# EAGLE design TeensyXBeeCan (EAGLE 7.7.0)
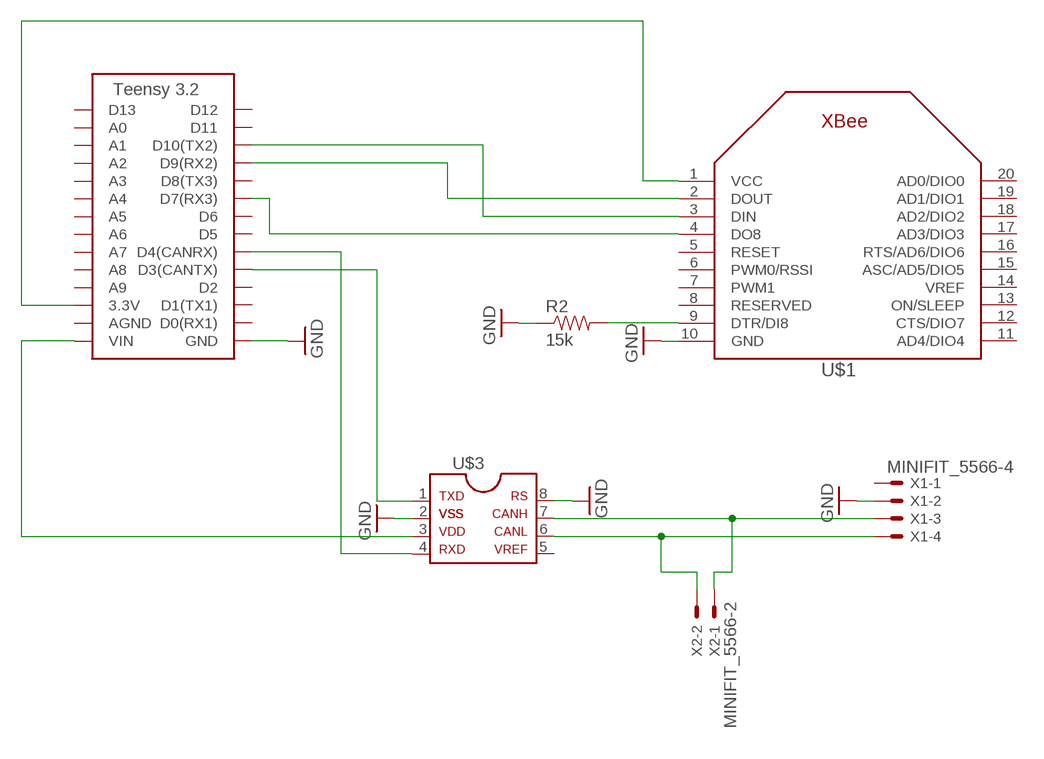
[diagram p0: schematic, sheet 1]

## Parts
R2  15k  RESISTOR0805-RES  [0805]
U$1  XBEE  [XBEE]
U$2  TEENSY_3.2_SIMPLE  [TEENSY_3.2_SIMPLE]
U$3  MCP2551  [SOIC-08]
X1  MINIFIT_5566-4  [MINIFIT_5566-4]
X2  MINIFIT_5566-2  [MINIFIT_5566-2]

## Nets
GND: R2.1 U$1.10(GND) U$2.GND U$3.2 U$3.8 X1.2
N$1: U$2.VIN U$3.3
N$2: U$1.2(DOUT) U$2.D9(RX2)
N$3: U$1.3(DIN) U$2.D10(TX2)
N$4: U$2.D3(CANTX) U$3.1
N$5: U$2.D4(CANRX) U$3.4
N$6: U$3.6 X1.4 X2.2
N$7: U$3.7 X1.3 X2.1
N$8: U$1.4(DO8) U$2.D7(RX3)
N$9: R2.2 U$1.9(DTR/DI8)
VCC: U$1.1(VCC) U$2.3.3V
Unconnected: U$1.5(RESET) U$1.6(PWM0/RSSI) U$1.7(PWM1) U$1.8(RESERVED) U$1.11(AD4/DIO4) U$1.12(CTS/DIO7) U$1.13(ON/SLEEP) U$1.14(VREF) U$1.15(ASC/AD5/DIO5) U$1.16(RTS/AD6/DIO6) U$1.17(AD3/DIO3) U$1.18(AD2/DIO2) U$1.19(AD1/DIO1) U$1.20(AD0/DIO0) U$2.A0 U$2.A1 U$2.A2 U$2.A3 U$2.A4 U$2.A5 U$2.A6 U$2.A7 U$2.A8 U$2.A9 U$2.AGND U$2.D0(RX1) U$2.D1(TX1) U$2.D2 U$2.D5 U$2.D6 U$2.D8(TX3) U$2.D11 U$2.D12 U$2.D13 U$3.5 X1.1

## Library data of the parts
R2 = HyTechDevices:RESISTOR: Resistor Basic schematic elements and footprints for 0603, 1206, and PTH resistors.
U$1 = HyTechDevices:XBEE: Source: Adafruit <https://github.com/adafruit/Adafruit-Eagle-Library>
U$2 = HyTechDevices:TEENSY_3.2_SIMPLE: Simple version of the Teensy 3.2 board that only uses the 2 main rows of pins, not the inner pins or the pins opposite the usb port.
U$3 = HyTechDevices:MCP2551: MCP2551 High-Speed CAN Transceiver Product Webpage <https://www.microchip.com/wwwproducts/en/MCP2551> Datasheet <http://ww1.microchip.com/downloads/en/DeviceDoc/21667f.pdf> This device is outdated It is replaced by MCP2561. Comparison Page <https://www.microchip.com/wwwproducts/ProductCompare/MCP2551/MCP2561> Product Webpage <https://www.microchip.com/wwwproducts/en/MCP2561> Datasheet <http://ww1.microchip.com/downloads/en/DeviceDoc/20005167C.pdf>
X1 = HyTechDevices:MINIFIT_5566-4: Mini-Fit Junior connector 4 pole Source: http://www.molex.com; OC_FARNELL: unknown; OC_NEWARK: unknown
X2 = HyTechDevices:MINIFIT_5566-2: Mini-Fit Junior connector 2 pole Source: http://www.molex.com; OC_FARNELL: 1822072; OC_NEWARK: unknown

## Board
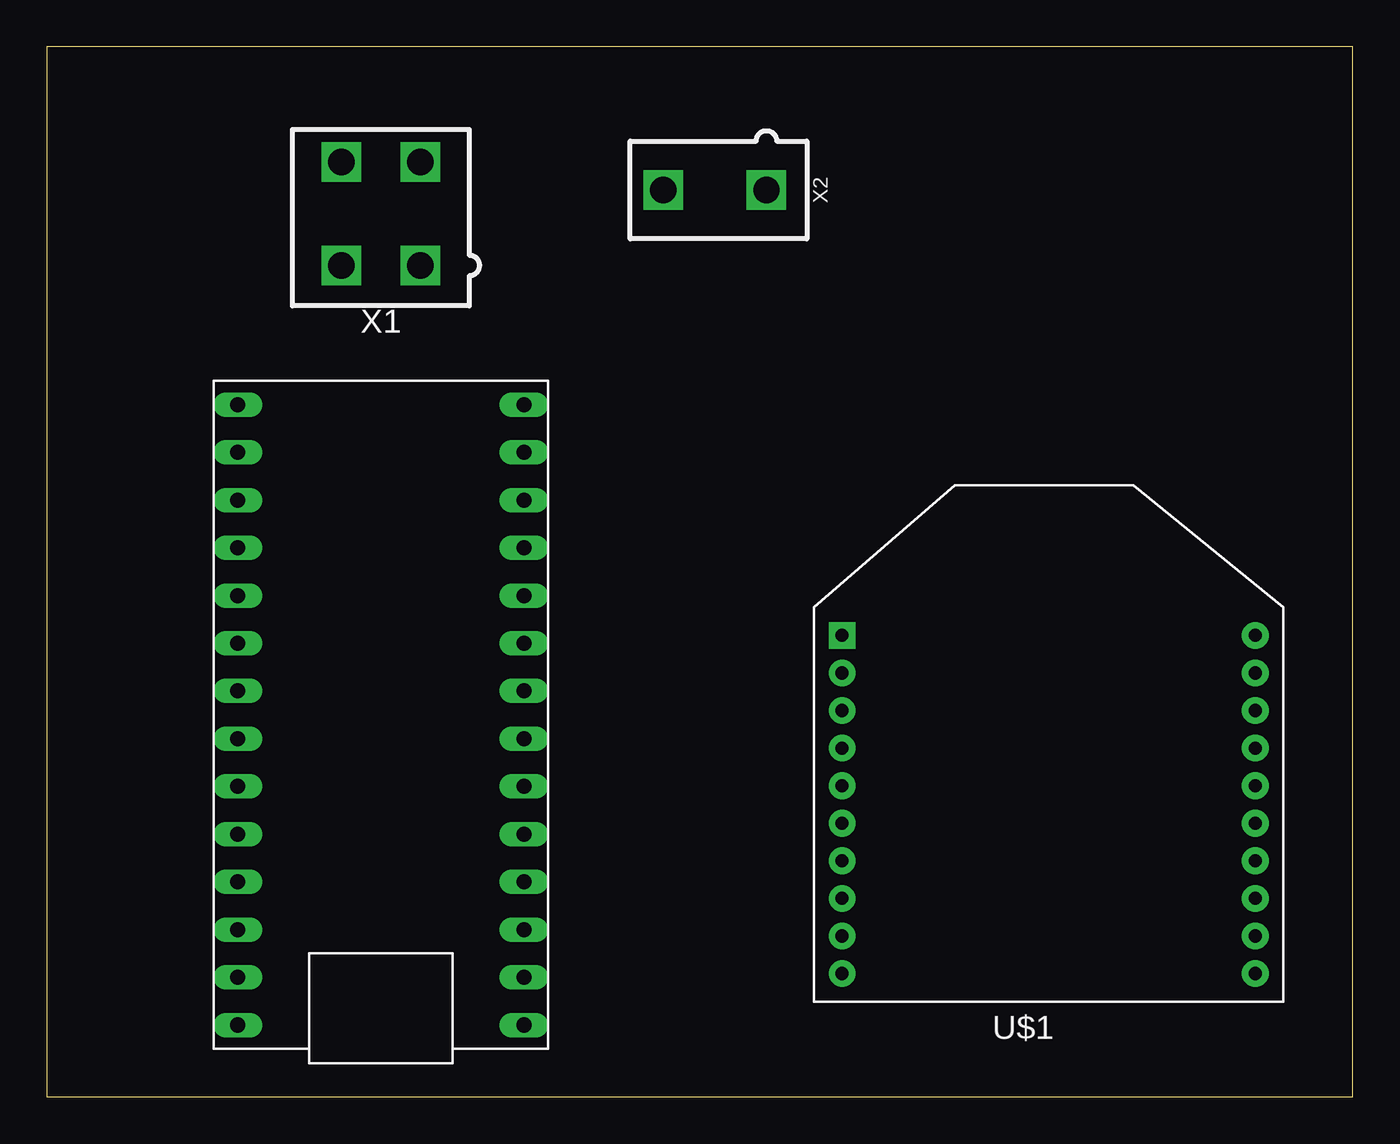
[diagram p1: board, top side]
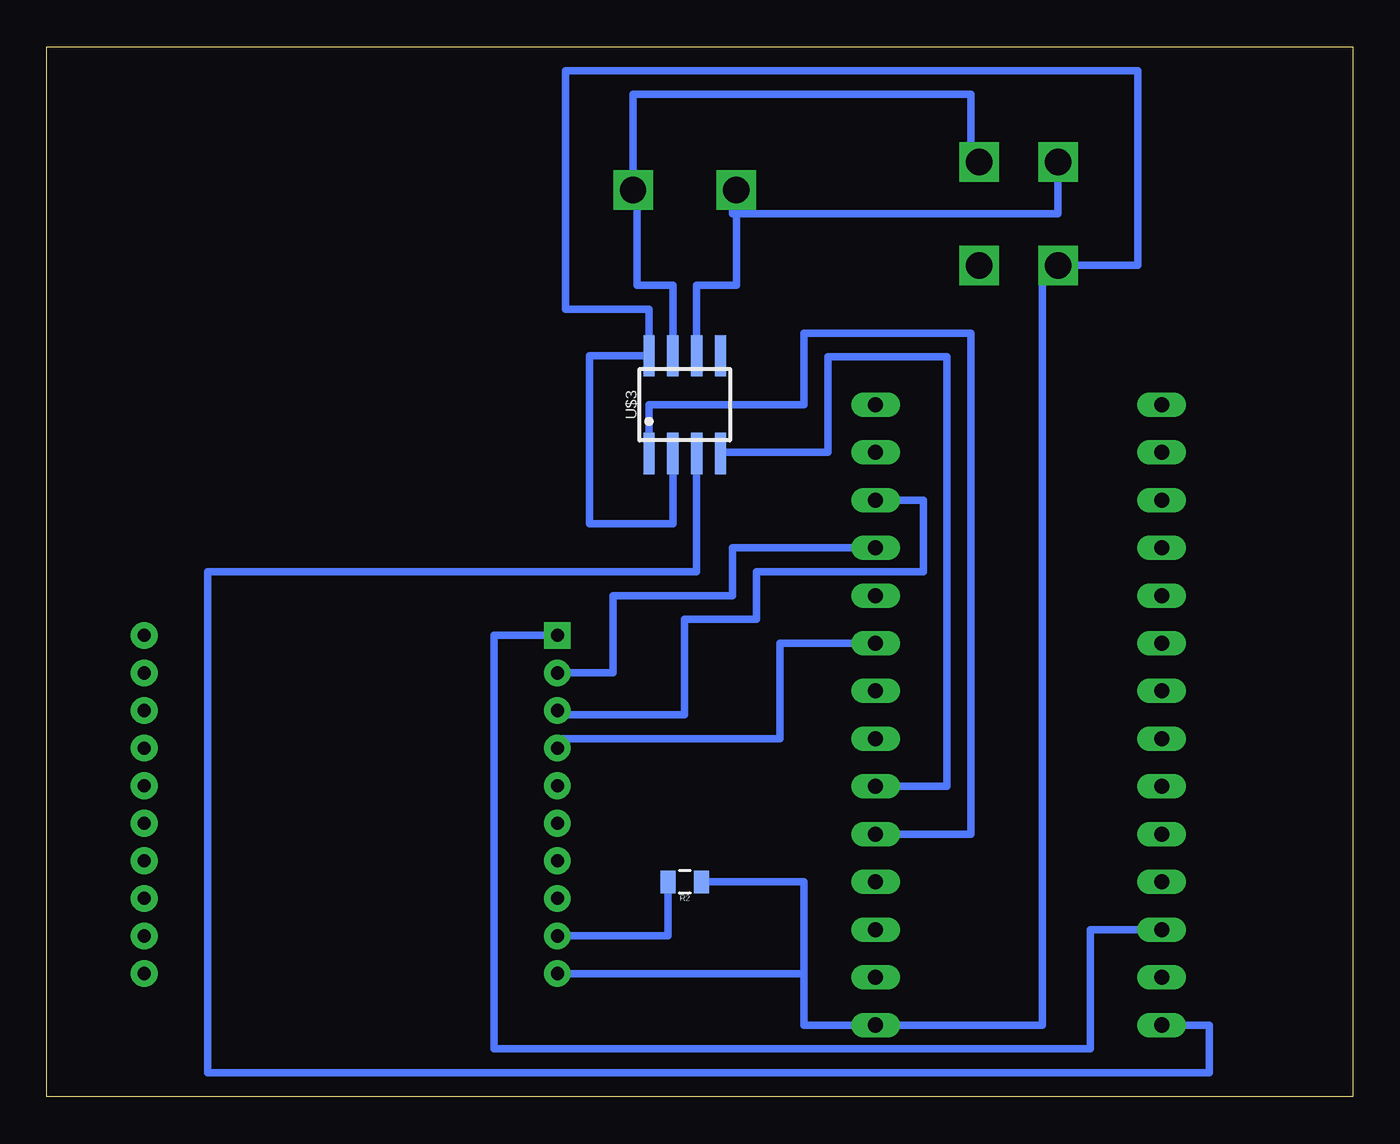
[diagram p2: board, bottom side, seen from below]

Size 69.52 x 55.87 mm. Coordinates in mm from the lower left corner, seen from the top.
Outline: 0,0 69.52,0 69.52,55.87 0,55.87 0,0
Copper layers (1*16): Top 0.035mm / dielectric 1.5mm / Bottom 0.035mm
Design rules "default": minimum track width 10mil, minimum drill 24mil, track to track 8mil, track to pad 8mil, pad to pad 8mil, via to via 8mil, smd to smd 8mil, copper to edge 40mil, drill to drill 8mil, minimum pad ring 10mil, minimum via ring 8mil, stop-mask expansion 4mil, vias tented up to drill 0mil, thermal gap 10mil

### Footprints (pad centres in the part's own frame; a part is rotated, then mirrored left to right if it is on the bottom)
0805 = smd 0.8 x 1.2: 1 -0.9,0; 2 0.9,0
XBEE = drill 0.7 pad 1.422 square: 1 -11,5.5 | drill 0.7 pad 1.422: 2 -11,3.5; 3 -11,1.5; 4 -11,-0.5; 5 -11,-2.5; 6 -11,-4.5; 7 -11,-6.5; 8 -11,-8.5; 9 -11,-10.5; 10 -11,-12.5; 11 11,-12.5; 12 11,-10.5; 13 11,-8.5; 14 11,-6.5; 15 11,-4.5; 16 11,-2.5; 17 11,-0.5; 18 11,1.5; 19 11,3.5; 20 11,5.5
TEENSY_3.2_SIMPLE = drill 0.8 long: 3.3V 16.51,29.21; A0 16.51,3.81; A1 16.51,6.35; A2 16.51,8.89; A3 16.51,11.43; A4 16.51,13.97; A5 16.51,16.51; A6 16.51,19.05; A7 16.51,21.59; A8 16.51,24.13; A9 16.51,26.67; AGND 16.51,31.75; D0(RX1) 1.27,31.75; D1(TX1) 1.27,29.21; D2 1.27,26.67; D3(CANTX) 1.27,24.13; D4(CANRX) 1.27,21.59; D5 1.27,19.05; D6 1.27,16.51; D7(RX3) 1.27,13.97; D8(TX3) 1.27,11.43; D9(RX2) 1.27,8.89; D10(TX2) 1.27,6.35; D11 1.27,3.81; D12 1.27,1.27; D13 16.51,1.27; GND 1.27,34.29; VIN 16.51,34.29
SOIC-08 = smd 0.6 x 2.2: 1 -1.905,-2.6; 2 -0.635,-2.6; 3 0.635,-2.6; 4 1.905,-2.6; 5 1.905,2.6; 6 0.635,2.6; 7 -0.635,2.6; 8 -1.905,2.6
MINIFIT_5566-4 = drill 1.4 square: 1 2.1,-2.75; 2 -2.1,-2.75; 3 2.1,2.75; 4 -2.1,2.75
MINIFIT_5566-2 = drill 1.4 square: 1 0,-2.75; 2 0,2.75

### Placement (x,y rotation side)
R2  35.56,11.43 180 bottom
U$1  53.34,19.05 0 top
U$2  26.67,38.1 180 top
U$3  35.56,36.83 0 bottom
X1  17.78,46.99 0 top
X2  35.56,48.26 90 top

### Tracks (layer width: path | path; a pad name or v marks a point on that pad's centre or on a via)
GND
  Bottom 0.406: R2.1 29.21,11.43 29.21,6.55 | U$1.10 29.21,6.55 | 29.21,6.55 29.21,3.81 U$2.GND 16.51,3.81 16.51,44.24 X1.2 11.43,44.24 11.43,54.61 41.91,54.61 41.91,41.91 37.47,41.91 U$3.8 40.64,39.43 40.64,30.48 36.2,30.48 U$3.2
N$1
  Bottom 0.406: U$3.3 34.92,27.94 60.96,27.94 60.96,1.27 7.62,1.27 7.62,3.81 U$2.VIN
N$2
  Bottom 0.406: U$2.D9(RX2) 33.02,29.21 33.02,26.67 39.37,26.67 39.37,22.55 U$1.2
N$3
  Bottom 0.406: U$1.3 42.34,20.32 35.56,20.32 35.56,25.4 31.75,25.4 31.75,27.94 22.86,27.94 22.86,31.75 U$2.D10(TX2)
N$4
  Bottom 0.406: U$3.1 37.47,36.83 29.21,36.83 29.21,40.64 20.32,40.64 20.32,13.97 U$2.D3(CANTX)
N$5
  Bottom 0.406: U$3.4 33.66,34.29 27.94,34.29 27.94,39.37 21.59,39.37 21.59,16.51 U$2.D4(CANRX)
N$6
  Bottom 0.406: X1.4 15.68,46.99 33.02,46.99 33.02,48.26 X2.2 32.81,43.18 34.92,43.18 U$3.6
N$7
  Bottom 0.406: U$3.7 36.2,43.18 38.1,43.18 38.1,48.26 X2.1 38.31,53.34 20.32,53.34 20.32,49.74 X1.3
N$8
  Bottom 0.406: U$2.D7(RX3) 30.48,24.13 30.48,19.05 42.34,19.05 U$1.4
N$9
  Bottom 0.406: U$1.9 36.46,8.55 R2.2
VCC
  Bottom 0.406: U$2.3.3V 13.97,8.89 13.97,2.54 45.72,2.54 45.72,24.55 U$1.1